# EAGLE design Board (EAGLE 8.7.0)
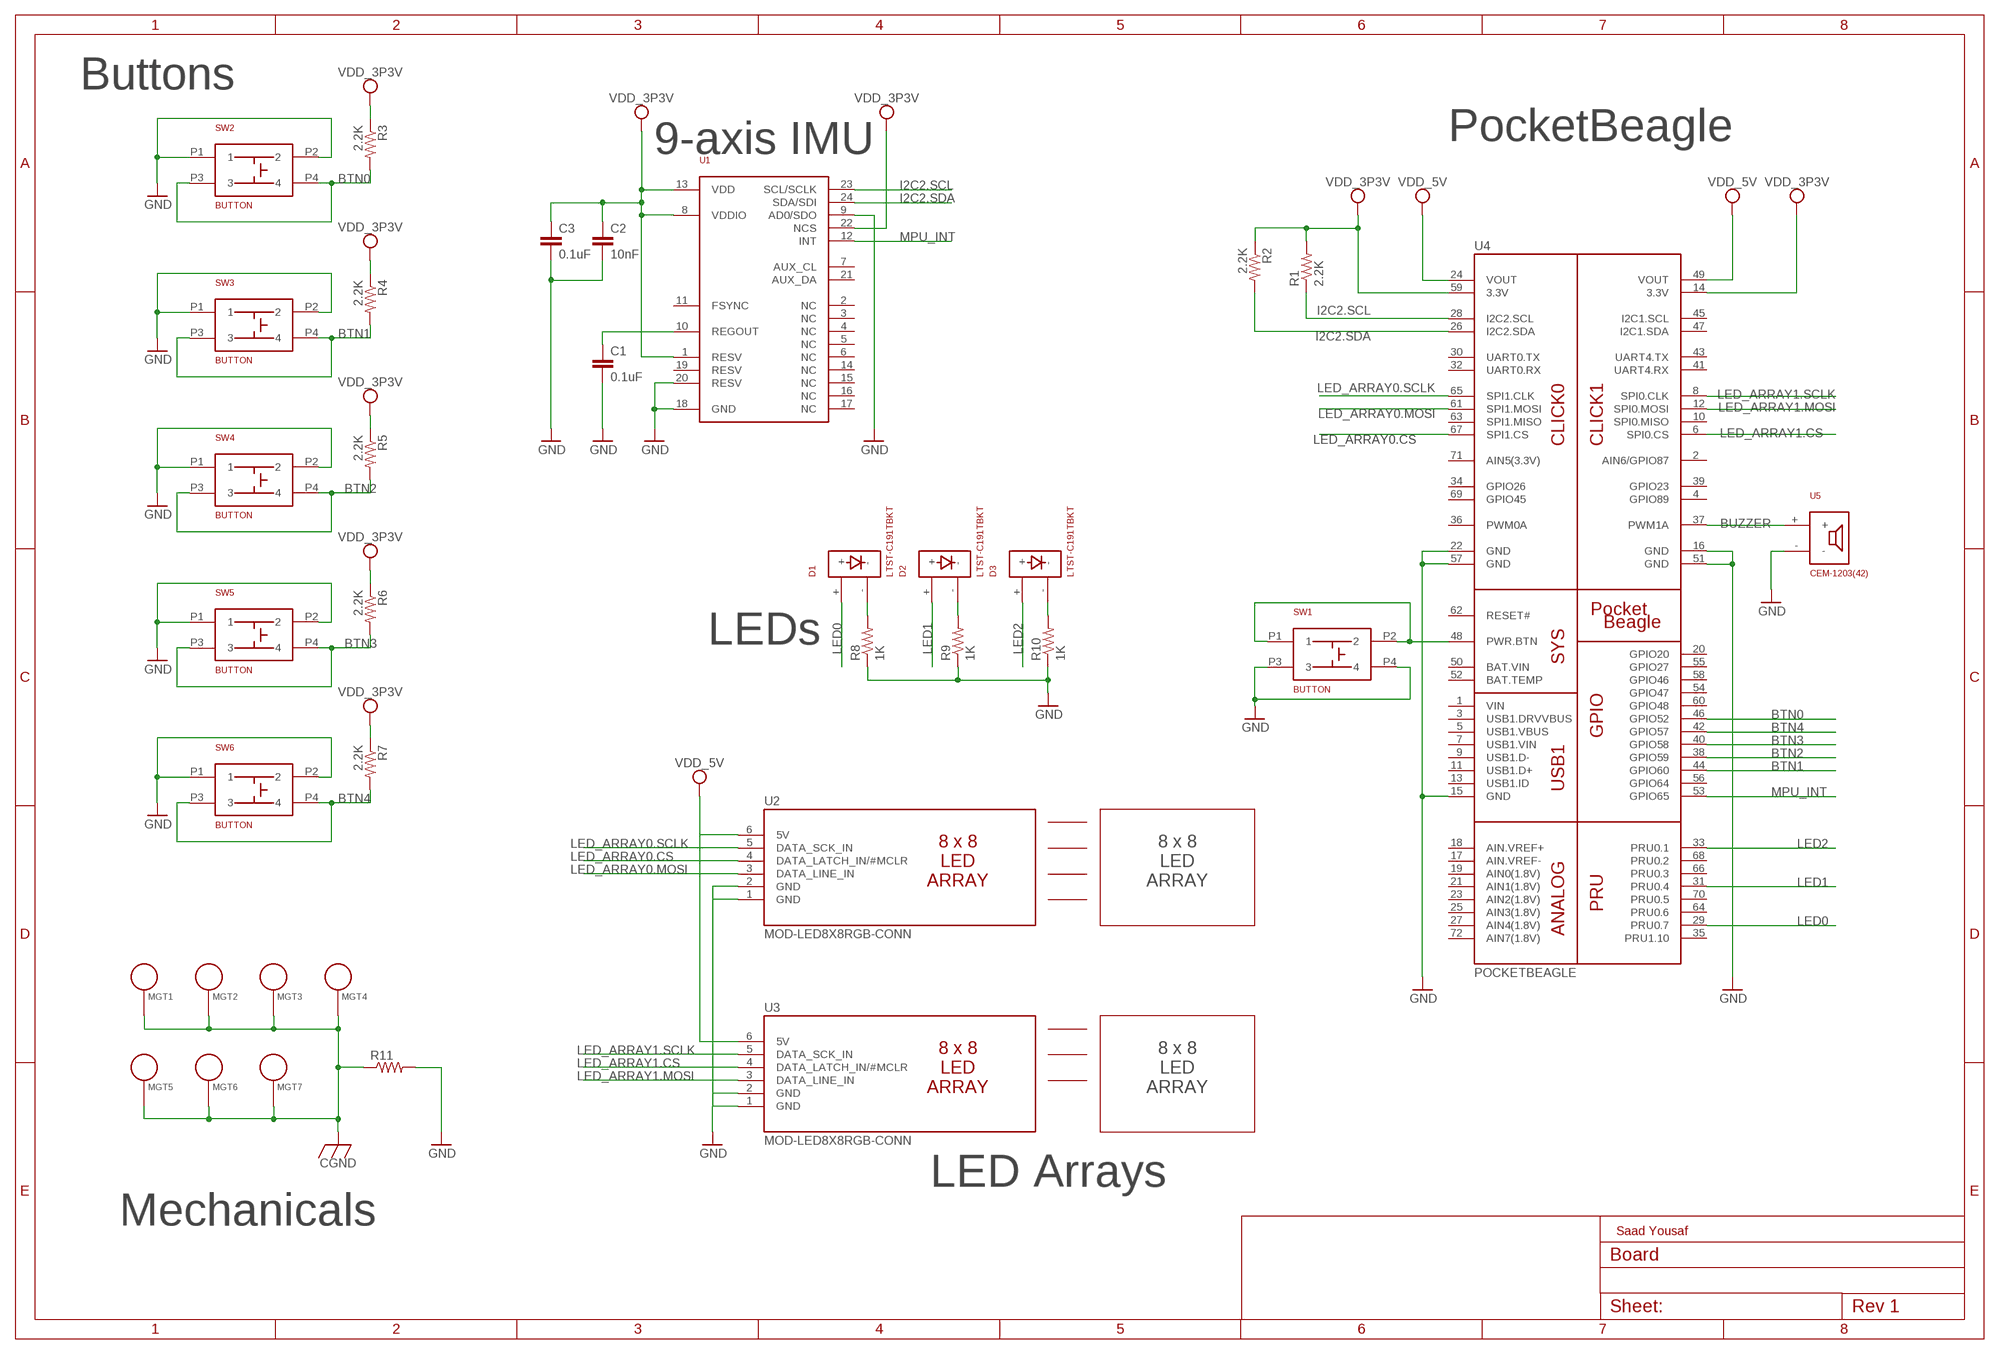
[diagram p0: schematic, sheet 1]

## Parts
C1  0.1uF  C_C0603  [C0603]
C2  10nF  C_C0603  [C0603]
C3  0.1uF  C_C0603  [C0603]
D1  LTST-C191TBKT  [SMD-LED]
D2  LTST-C191TBKT  [SMD-LED]
D3  LTST-C191TBKT  [SMD-LED]
MGT1  MOUNTING_HOLE  [MOUNTING_HOLE]
MGT2  MOUNTING_HOLE  [MOUNTING_HOLE]
MGT3  MOUNTING_HOLE  [MOUNTING_HOLE]
MGT4  MOUNTING_HOLE  [MOUNTING_HOLE]
MGT5  MOUNTING_HOLE  [MOUNTING_HOLE]
MGT6  MOUNTING_HOLE  [MOUNTING_HOLE]
MGT7  MOUNTING_HOLE  [MOUNTING_HOLE]
R1  2.2K  R_R0603  [R0603]
R2  2.2K  R_R0603  [R0603]
R3  2.2K  R_R0603  [R0603]
R4  2.2K  R_R0603  [R0603]
R5  2.2K  R_R0603  [R0603]
R6  2.2K  R_R0603  [R0603]
R7  2.2K  R_R0603  [R0603]
R8  1K  R_R0603  [R0603]
R9  1K  R_R0603  [R0603]
R10  1K  R_R0603  [R0603]
R11  R_R0603  [R0603]
SW1  BUTTON  [BTN]
SW2  BUTTON  [BTN]
SW3  BUTTON  [BTN]
SW4  BUTTON  [BTN]
SW5  BUTTON  [BTN]
SW6  BUTTON  [BTN]
U1  MPU-9250  [QFN-3MMX3MM]
U2  MOD-LED8X8RGB-CONN  [FE06W]
U3  MOD-LED8X8RGB-CONN  [FE06W]
U4  POCKETBEAGLE  [POCKETBEAGLE]
U5  CEM-1203(42)  [CEM-1203(42)]

## Nets
BTN0: R3.2 SW2.P3 SW2.P4 U4.46(GPIO52)
BTN1: R4.2 SW3.P3 SW3.P4 U4.44(GPIO60)
BTN2: R5.2 SW4.P3 SW4.P4 U4.38(GPIO59)
BTN3: R6.2 SW5.P3 SW5.P4 U4.40(GPIO58)
BTN4: R7.2 SW6.P3 SW6.P4 U4.42(GPIO57)
BUZZER: U4.37(PWM1A) U5.+
CGND: MGT1.P$1 MGT2.P$1 MGT3.P$1 MGT4.P$1 MGT5.P$1 MGT6.P$1 MGT7.P$1 R11.1
GND: C1.2 C2.2 C3.2 R8.1 R9.1 R10.1 R11.2 SW1.P3 SW1.P4 SW2.P1 SW2.P2 SW3.P1 SW3.P2 SW4.P1 SW4.P2 SW5.P1 SW5.P2 SW6.P1 SW6.P2 U1.9(AD0/SDO) U1.18(GND) U1.20(RESV) U2.1(GND) U2.2(GND) U3.1(GND) U3.2(GND) U4.15(GND) U4.16(GND) U4.22(GND) U4.51(GND) U4.57(GND) U5.-
I2C2.SCL: R1.1 U1.23(SCL/SCLK) U4.28(I2C2.SCL)
I2C2.SDA: R2.2 U1.24(SDA/SDI) U4.26(I2C2.SDA)
LED0: D1.+ U4.29(PRU0.7)
LED1: D2.+ U4.31(PRU0.4)
LED2: D3.+ U4.33(PRU0.1)
LED_ARRAY0.CS: U2.4(DATA_LATCH_IN/#MCLR) U4.67(SPI1.CS)
LED_ARRAY0.MOSI: U2.3(DATA_LINE_IN) U4.61(SPI1.MOSI)
LED_ARRAY0.SCLK: U2.5(DATA_SCK_IN) U4.65(SPI1.CLK)
LED_ARRAY1.CS: U3.4(DATA_LATCH_IN/#MCLR) U4.6(SPI0.CS)
LED_ARRAY1.MOSI: U3.3(DATA_LINE_IN) U4.12(SPI0.MOSI)
LED_ARRAY1.SCLK: U3.5(DATA_SCK_IN) U4.8(SPI0.CLK)
MPU_INT: U1.12(INT) U4.53(GPIO65)
N$2: C1.1 U1.10(REGOUT)
N$23: SW1.P1 SW1.P2 U4.48(PWR.BTN)
N$35: D1.- R8.2
N$37: D2.- R9.2
N$39: D3.- R10.2
SYS_VDD1_5V: C2.1 C3.1 R1.2 R2.1 R3.1 R4.1 R5.1 R6.1 R7.1 U1.1(RESV) U1.8(VDDIO) U1.13(VDD) U1.22(NCS) U2.6(5V) U3.6(5V) U4.14(3.3V) U4.24(VOUT) U4.49(VOUT) U4.59(3.3V) ; supply symbol labelled VDD_3P3V, VDD_5V
Unconnected: U1.2(NC) U1.3(NC) U1.4(NC) U1.5(NC) U1.6(NC) U1.7(AUX_CL) U1.11(FSYNC) U1.14(NC) U1.15(NC) U1.16(NC) U1.17(NC) U1.19(RESV) U1.21(AUX_DA) U4.1(VIN) U4.2(AIN6/GPIO87) U4.3(USB1.DRVVBUS) U4.4(GPIO89) U4.5(USB1.VBUS) U4.7(USB1.VIN) U4.9(USB1.D-) U4.10(SPI0.MISO) U4.11(USB1.D+) U4.13(USB1.ID) U4.17(AIN.VREF-) U4.18(AIN.VREF+) U4.19(AIN0(1.8V)) U4.20(GPIO20) U4.21(AIN1(1.8V)) U4.23(AIN2(1.8V)) U4.25(AIN3(1.8V)) U4.27(AIN4(1.8V)) U4.30(UART0.TX) U4.32(UART0.RX) U4.34(GPIO26) U4.35(PRU1.10) U4.36(PWM0A) U4.39(GPIO23) U4.41(UART4.RX) U4.43(UART4.TX) U4.45(I2C1.SCL) U4.47(I2C1.SDA) U4.50(BAT.VIN) U4.52(BAT.TEMP) U4.54(GPIO47) U4.55(GPIO27) U4.56(GPIO64) U4.58(GPIO46) U4.60(GPIO48) U4.62(RESET#) U4.63(SPI1.MISO) U4.64(PRU0.6) U4.66(PRU0.3) U4.68(PRU0.2) U4.69(GPIO45) U4.70(PRU0.5) U4.71(AIN5(3.3V)) U4.72(AIN7(1.8V))

## Notes on the sheet
- Buttons
- 9-axis IMU | PocketBeagle
- LEDs
- 8 x 8
  LED
  ARRAY
- 8 x 8
  LED
  ARRAY
- LED Arrays
- Mechanicals
- Saad Yousaf

## Library data of the parts
C1-C3 = ENGI301_PCB_design_project:C_: Capacitor SMD. Sizes: 0402, 0603 & 0805
D1-D3 = ENGI301_PCB_design_project:LTST-C191TBKT
MGT1-MGT7 = ENGI301_PCB_design_project:MOUNTING_HOLE: Chassis Mounting Hole w/GND connection ability
R1-R11 = ENGI301_PCB_design_project:R_: RESISTOR, American symbol
SW1-SW6 = ENGI301_PCB_design_project:BUTTON
U1 = ENGI301_PCB_design_project:MPU-9250: MPU-9250 9-Axis IMU
U2 U3 = ENGI301_Maze_Project_Parts:MOD-LED8X8RGB-CONN
U4 = ENGI301_Maze_Project_Parts:POCKETBEAGLE
U5 = ENGI301_PCB_design_project:CEM-1203(42)

## Board
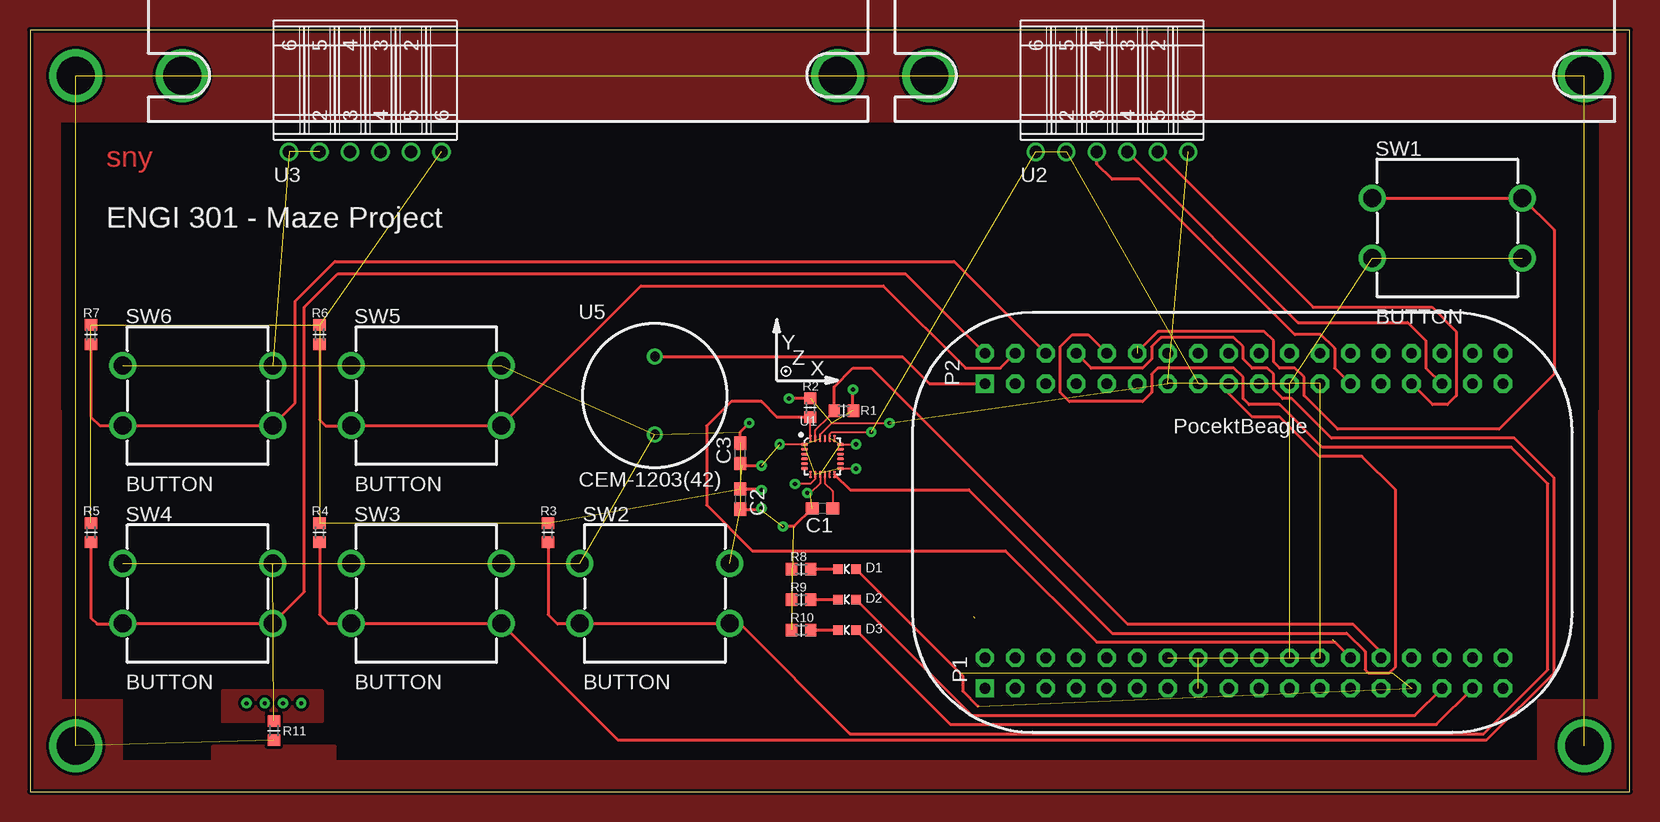
[diagram p1: board, top side]
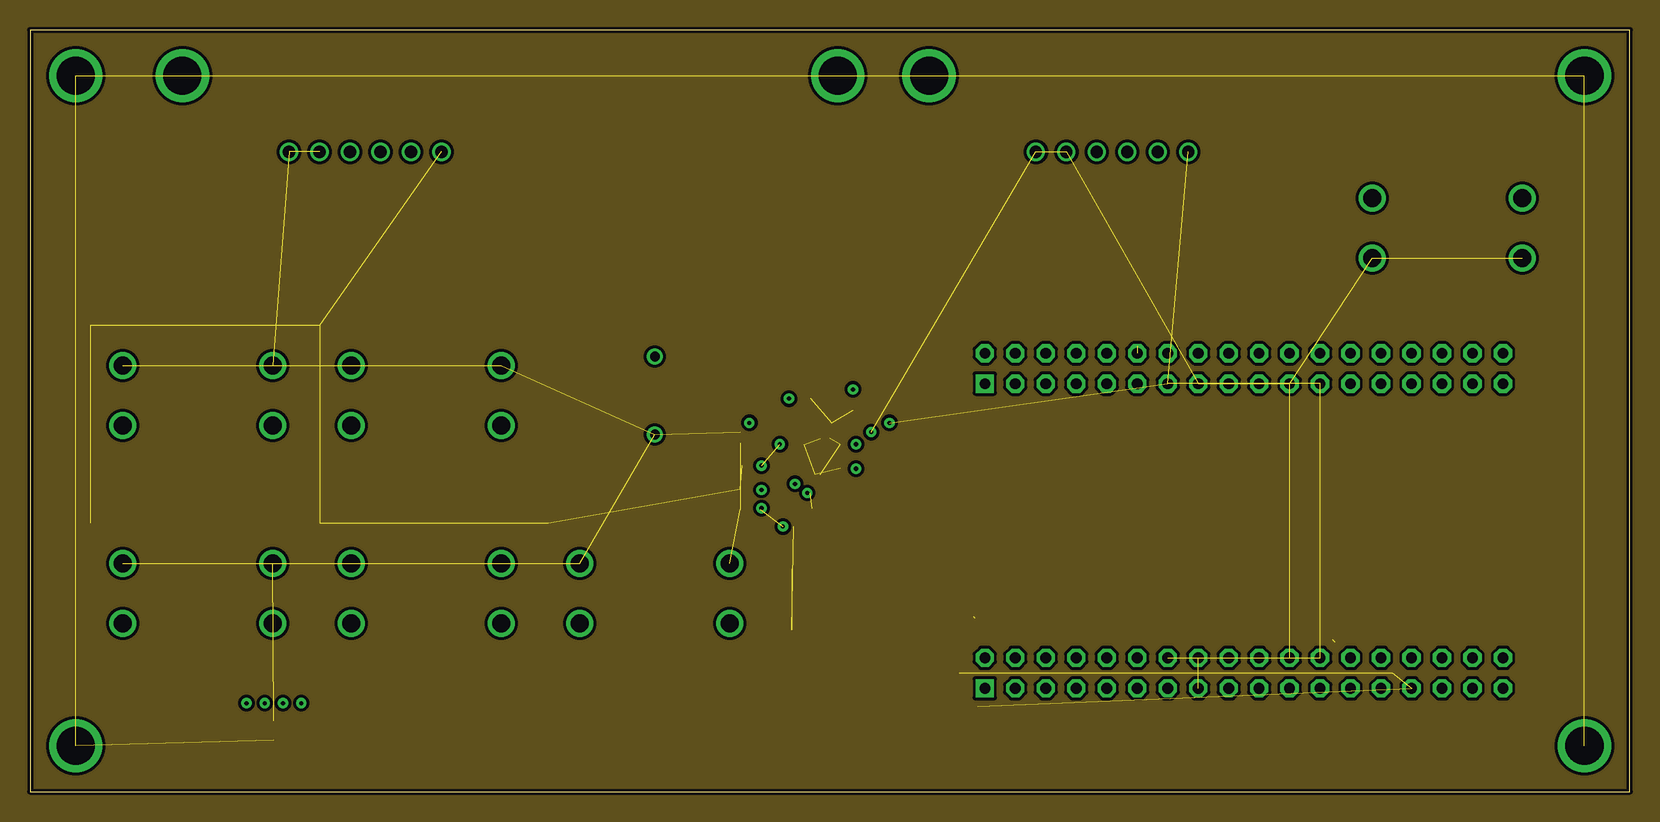
[diagram p2: board, inner layer Route2]
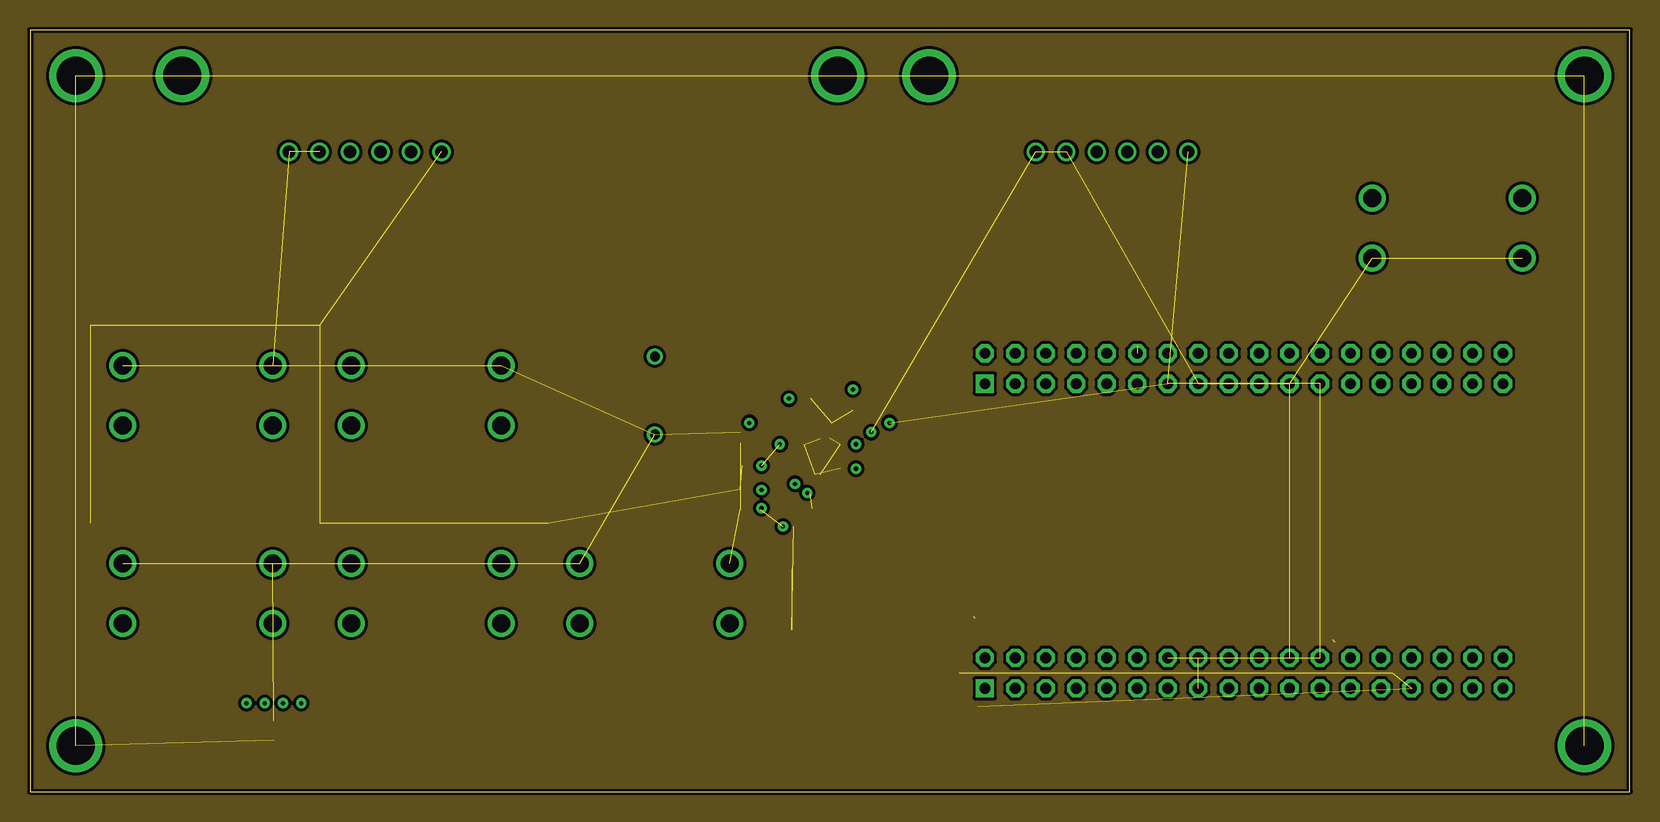
[diagram p3: board, inner layer Route15]
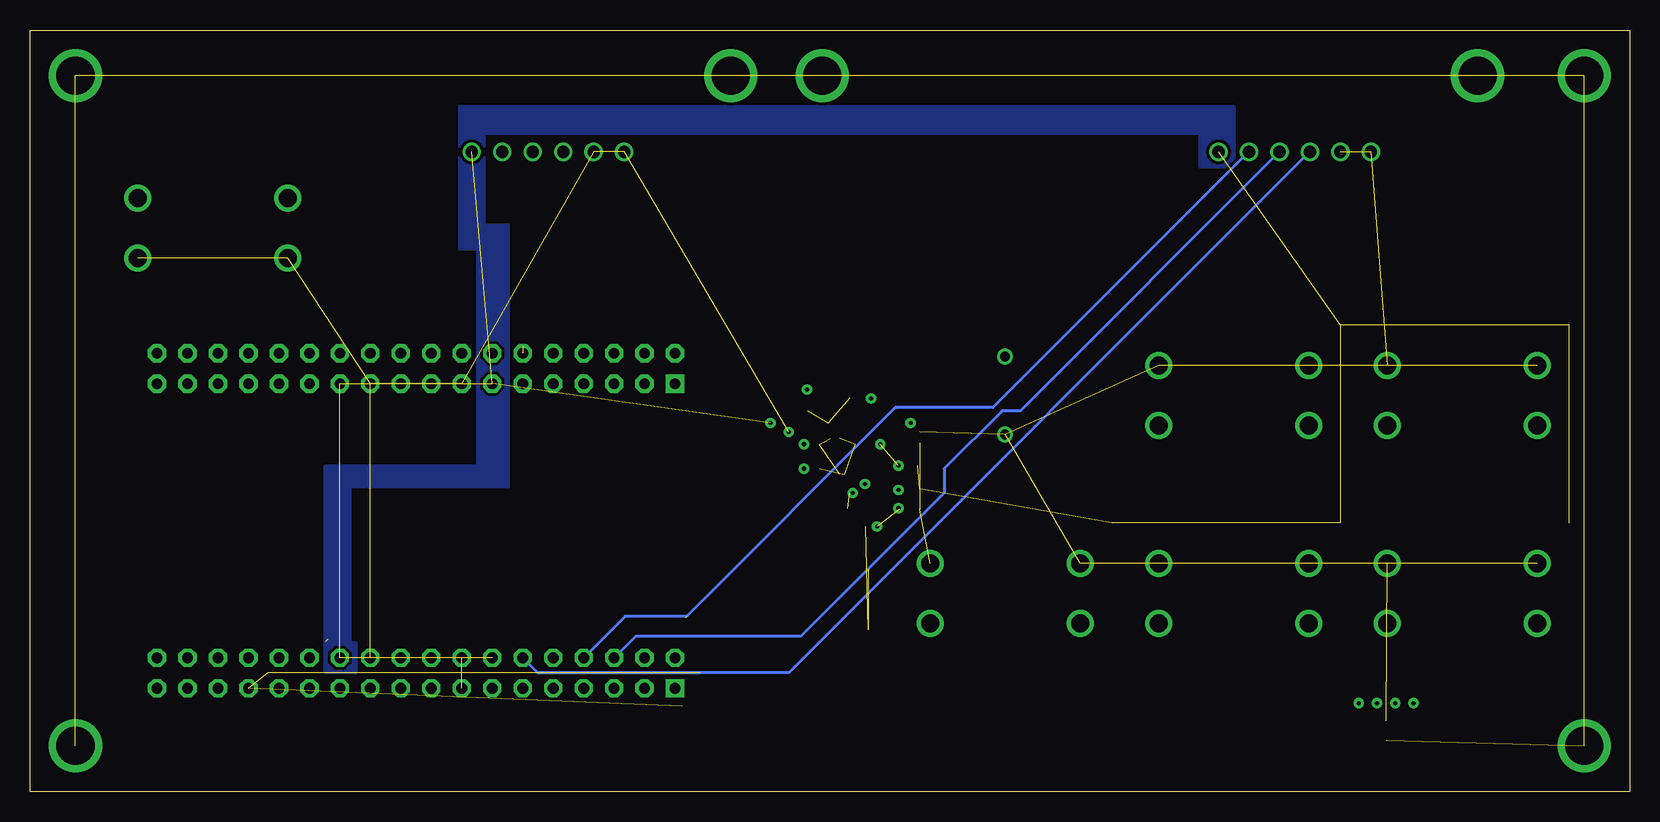
[diagram p4: board, bottom side, seen from below]

Size 133.33 x 63.5 mm. Coordinates in mm from the lower left corner, seen from the top.
Outline: 0,0 133.33,0 133.33,63.5 0,63.5 0,0
Copper layers (1*2*15*16): Top 0.035mm / dielectric 0.23mm / Route2 0.035mm / dielectric 0.93mm / Route15 0.035mm / dielectric 0.23mm / Bottom 0.035mm
Design rules "ENGI301_Maze_Project_4lyr": minimum track width 10mil, minimum drill 12mil, track to track 10mil, track to pad 10mil, pad to pad 10mil, via to via 10mil, smd to smd 10mil, copper to edge 10mil, drill to drill 12mil, minimum pad ring 10mil, minimum via ring 10mil, stop-mask expansion 3mil, vias tented up to drill 25mil, thermal gap 10mil

### Footprints (pad centres in the part's own frame; a part is rotated, then mirrored left to right if it is on the bottom)
C0603 = smd 1.1 x 1: 1 -0.85,0; 2 0.85,0
SMD-LED = smd 0.8 x 0.8: + 0.75,0; - -0.75,0
MOUNTING_HOLE = drill 3.175 pad 4.445: P$1 0,0
R0603 = smd 0.95 x 1.031: 1 -0.8,0; 2 0.8,0
BTN = drill 1.5: P1 -6.25,2.5; P2 6.25,2.5; P3 -6.25,-2.5; P4 6.25,-2.5
QFN-3MMX3MM = smd 0.6 x 0.2: 1 -1.5,1; 2 -1.5,0.6; 3 -1.5,0.2; 4 -1.5,-0.2; 5 -1.5,-0.6; 6 -1.5,-1; 13 1.5,-1; 14 1.5,-0.6; 15 1.5,-0.2; 16 1.5,0.2; 17 1.5,0.6; 18 1.5,1 | smd 0.2 x 0.6: 7 -1,-1.5; 8 -0.6,-1.5; 9 -0.2,-1.5; 10 0.2,-1.5; 11 0.6,-1.5; 12 1,-1.5; 19 1,1.5; 20 0.6,1.5; 21 0.2,1.5; 22 -0.2,1.5; 23 -0.6,1.5; 24 -1,1.5
FE06W = drill 1.016: 1 -6.35,0; 2 -3.81,0; 3 -1.27,0; 4 1.27,0; 5 3.81,0; 6 6.35,0
POCKETBEAGLE = drill 0.889 pad 1.524 square: 1 5.91,3.53; 37 5.91,28.93 | drill 0.889 pad 1.524 octagon: 2 5.91,6.07; 3 8.45,3.53; 4 8.45,6.07; 5 10.99,3.53; 6 10.99,6.07; 7 13.53,3.53; 8 13.53,6.07; 9 16.07,3.53; 10 16.07,6.07; 11 18.61,3.53; 12 18.61,6.07; 13 21.15,3.53; 14 21.15,6.07; 15 23.69,3.53; 16 23.69,6.07; 17 26.23,3.53; 18 26.23,6.07; 19 28.77,3.53; 20 28.77,6.07; 21 31.31,3.53; 22 31.31,6.07; 23 33.85,3.53; 24 33.85,6.07; 25 36.39,3.53; 26 36.39,6.07; 27 38.93,3.53; 28 38.93,6.07; 29 41.47,3.53; 30 41.47,6.07; 31 44.01,3.53; 32 44.01,6.07; 33 46.55,3.53; 34 46.55,6.07; 35 49.09,3.53; 36 49.09,6.07; 38 5.91,31.47; 39 8.45,28.93; 40 8.45,31.47; 41 10.99,28.93; 42 10.99,31.47; 43 13.53,28.93; 44 13.53,31.47; 45 16.07,28.93; 46 16.07,31.47; 47 18.61,28.93; 48 18.61,31.47; 49 21.15,28.93; 50 21.15,31.47; 51 23.69,28.93; 52 23.69,31.47; 53 26.23,28.93; 54 26.23,31.47; 55 28.77,28.93; 56 28.77,31.47; 57 31.31,28.93; 58 31.31,31.47; 59 33.85,28.93; 60 33.85,31.47; 61 36.39,28.93; 62 36.39,31.47; 63 38.93,28.93; 64 38.93,31.47; 65 41.47,28.93; 66 41.47,31.47; 67 44.01,28.93; 68 44.01,31.47; 69 46.55,28.93; 70 46.55,31.47; 71 49.09,28.93; 72 49.09,31.47
CEM-1203(42) = drill 0.8: + 0,3.25; - 0,-3.25

### Placement (x,y rotation side)
C1  66.04,23.62 180 top
C2  59.18,24.38 270 top
C3  59.18,28.19 90 top
D1  68.07,18.54 0 top
D2  68.07,16 0 top
D3  68.07,13.46 0 top
MGT1  3.81,3.81 0 top
MGT2  74.93,59.69 0 top
MGT3  12.7,59.69 0 top
MGT4  129.54,3.81 0 top
MGT5  3.81,59.69 0 top
MGT6  67.31,59.69 0 top
MGT7  129.54,59.69 0 top
R1  67.82,31.75 0 top
R2  65.02,32 270 top
R3  43.18,21.59 270 top
R4  24.13,21.59 270 top
R5  5.08,21.59 270 top
R6  24.13,38.1 270 top
R7  5.08,38.1 270 top
R8  64.26,18.54 0 top
R9  64.26,16 0 top
R10  64.26,13.46 0 top
R11  20.32,5.08 90 top
SW1  118.11,46.99 0 top
SW2  52.07,16.51 0 top
SW3  33.02,16.51 0 top
SW4  13.97,16.51 0 top
SW5  33.02,33.02 0 top
SW6  13.97,33.02 0 top
U1  66.04,27.94 0 top
U2  90.17,53.34 0 top
U3  27.94,53.34 0 top
U4  73.66,5.08 0 top
U5  52.07,33.02 0 top
U$1  [MOD-LED8X8RGB]  69.85,55.88 90 top
U$2  [MOD-LED8X8RGB]  132.08,55.88 90 top
U$3  [MOD-LED8X8RGB]  132.08,116.84 90 top  (outside the outline)
U$4  [MOD-LED8X8RGB]  69.85,116.84 90 top  (outside the outline)
U$5  [XYZ-LABEL]  62.23,34.29 0 top

### Tracks (layer width: path | path; a pad name or v marks a point on that pad's centre or on a via)
BTN0
  Top 0.254: R3.2 43.18,14.73 43.94,13.97 43.98,14.01 SW2.P3 SW2.P4 59.14,14.01 68.33,4.83 121.16,4.83 126.49,10.16 126.49,25.65 123.44,28.7 107.7,28.7 104.14,32.26 101.6,32.26 101.09,32.77 101.09,34.54 100.33,35.31 93.98,35.31 93.47,34.8 93.47,33.27 92.71,32.51 86.61,32.51 85.85,33.27 85.85,37.08 86.87,38.1 88.18,38.1 U4.46
BTN1
  Top 0.254: R4.2 24.13,14.73 24.85,14.01 SW3.P3 SW3.P4 48.96,4.32 121.41,4.32 127,9.91 127,26.16 123.7,29.46 108.46,29.46 105.16,32.77 104.39,32.77 103.63,33.53 103.63,34.8 103.12,35.31 101.85,35.31 101.09,36.07 101.09,37.08 100.33,37.85 94.23,37.85 93.47,37.08 93.47,36.07 92.71,35.31 88.43,35.31 U4.44 87.4,36.55
BTN2
  Top 0.254: R5.2 5.08,14.48 5.59,13.97 7.68,13.97 SW4.P3 SW4.P4 22.86,16.65 22.86,40.39 25.65,43.18 72.94,43.18 U4.38
BTN3
  Top 0.254: R6.2 24.13,30.99 24.64,30.48 26.73,30.48 SW5.P3 SW5.P4 50.91,42.16 71.12,42.16 77.98,35.31 80.87,35.31 U4.40
BTN4
  Top 0.254: R7.2 5.08,31.24 5.84,30.48 5.88,30.52 SW6.P3 SW6.P4 22.1,32.4 22.1,40.89 25.4,44.2 77,44.2 U4.42
BUZZER
  Top 0.254: U5.+ 72.7,36.27 74.96,34.01 U4.37
CGND  (7 unrouted)
GND  (via drill 0.35)  (31 unrouted)
  Top 0.152: U1.18 68.82,28.94 v68.83,28.96 | U1.20 66.64,29.81 66.8,29.97 v70.1,29.97 | U1.9 65.84,25.71 65.02,24.89 v64.77,24.89
  Top 0.254: C1.2 63.67,22.1 v62.74,22.1 | C2.2 60.87,23.53 v60.96,23.62 | C3.2 59.18,29.97 v59.94,30.73
I2C2.SCL
  Top 0.152: U1.23 65.44,30.13 66.55,31.24 R1.1
  Top 0.254: R1.1 67.02,33.74 68.58,35.31 70.1,35.31 91.44,13.97 110.24,13.97 112.59,11.62 U4.28
I2C2.SDA  (1 unrouted)
  Top 0.152: U1.24 65.02,29.46 R2.2
  Top 0.254: R2.2 62.27,31.2 60.96,32.51 58.42,32.51 56.39,30.48 56.39,23.88 60.2,20.07 81.28,20.07 88.88,12.47 108.73,12.47 U4.26
LED0  (3 unrouted)
  Top 0.254: D1.+ 77.72,9.64 77.72,8.89 77.72,8.38 78.99,7.11
LED1
  Top 0.254: D2.+ 78.47,6.35 115.41,6.35 U4.31
LED2
  Top 0.254: D3.+ 76.7,5.59 117.19,5.59 U4.33
LED_ARRAY0.CS
  Top 0.254: U2.4 105.66,39.12 114.81,39.12 116.33,37.59 116.33,35.31 117.63,34.01 U4.67
LED_ARRAY0.MOSI
  Top 0.254: U4.61 110.01,34.01 108.71,35.31 108.71,36.96 107.58,38.1 105.41,38.1 92.46,51.05 90.17,51.05 88.9,52.32 U2.3
LED_ARRAY0.SCLK
  Top 0.254: U2.5 106.93,40.39 116.84,40.39 118.87,38.35 118.87,33.02 118.11,32.26 116.88,32.26 U4.65
LED_ARRAY1.CS
  Bottom 0.254: U3.4 50.8,31.75 52.32,31.75 57.15,26.92 57.15,24.89 69.09,12.95 82.85,12.95 U4.6
LED_ARRAY1.MOSI
  Bottom 0.254: U3.3 70.1,9.91 91.03,9.91 U4.12
LED_ARRAY1.SCLK  (1 unrouted)
  Bottom 0.254: U3.5 53.09,32 61.21,32 78.61,14.61 83.73,14.61 U4.8
MPU_INT
  Top 0.254: U1.12 68.33,25.15 78.23,25.15 90.17,13.21 109.73,13.21 111.25,11.68 111.25,10.16 111.51,9.91 113.28,9.91 113.79,10.41 113.79,25.15 111,27.94 107.44,27.94 104.14,31.24 101.85,31.24 99.89,33.21 U4.53
N$1
  pour Route2: -5.08,-5.08 138.43,-5.08 138.43,68.58 -5.08,68.58
N$2
  Top 0.152: U1.10 66.24,25.71 66.89,25.06 C1.1
N$3
  pour Top: -2.54,31.75 2.54,31.75 2.54,7.62 7.62,7.62 7.62,2.54 15.24,2.54 15.24,3.81 24.13,3.81 25.4,3.81 25.4,2.54 125.73,2.54 125.73,7.62 130.81,7.62 130.81,31.75 135.89,31.75 135.89,-2.54 -2.54,-2.54
N$4
  pour Route15: -7.62,71.12 -7.62,-7.62 140.97,-7.62 140.97,71.12
N$5
  pour Top: -2.54,31.75 2.54,31.75 2.54,55.88 130.81,55.88 130.81,31.75 135.89,31.75 135.89,66.04 -2.54,66.04
N$6
  pour Bottom: 106.43,9.91 108.46,9.91 108.71,9.91 108.71,13.72 108.71,27.18 98.3,27.18 96.01,27.18 96.01,33.02 96.01,45.21 96.27,45.21 97.54,45.21 97.54,56.39 97.54,57.15 33.02,57.15 33.02,52.07 35.81,52.07 35.81,54.86 95.25,54.86 95.5,54.86 95.5,47.24 93.98,47.24 93.47,47.24 93.47,26.16 93.47,25.4 106.68,25.4 106.68,12.45 106.43,12.45 106.17,12.45 106.17,9.91
N$7  (via drill 0.35)
  other vias: 19.56,7.37
N$8  (via drill 0.35)
  other vias: 21.08,7.37
N$9  (via drill 0.35)
  other vias: 22.61,7.37
N$10  (via drill 0.35)
  other vias: 18.03,7.37
N$12
  pour Top: 16,5.84 24.38,5.84 24.38,8.38 16,8.38
N$23  (1 unrouted)
  Top 0.254: SW1.P1 SW1.P2 127,46.85 127,34.8 122.43,30.23 108.97,30.23 106.17,33.02 106.17,34.54 105.41,35.31 104.14,35.31 103.63,35.81 103.63,37.59 102.87,38.35 93.98,38.35 92.27,36.64 U4.48
N$35
  Top 0.254: R8.2 D1.-
N$37
  Top 0.254: R9.2 D2.-
N$39
  Top 0.254: R10.2 D3.-
SYS_VDD1_5V  (via drill 0.35)  (18 unrouted)
  Top 0.152: U1.13 68.82,26.94 v68.83,26.92 | U1.1 64.52,28.96 v62.48,28.96 | U1.22 65.84,29.77 66.8,30.73 v71.63,30.73 | U1.8 65.44,26.07 65.02,25.65 v63.75,25.65
  Top 0.254: C2.1 60.87,25.23 v60.96,25.15 | C3.1 59.35,27.18 v60.96,27.18 | R2.1 64.99,32.77 v63.25,32.77 | R1.2 68.58,31.79 v68.58,33.53

### Text on the board
Top: sny
tNames: ENGI 301 - Maze Project